# EAGLE design supply (EAGLE 9.6.2)
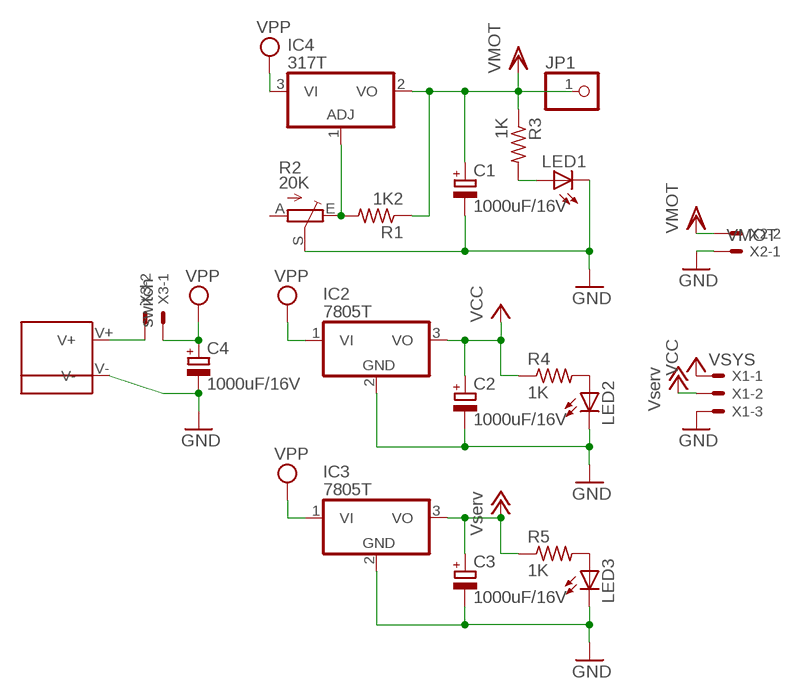
[diagram p0: schematic, sheet 1]

## Parts
C1  1000uF/16V  CPOL-EUE3.5-10  [E3,5-10]
C2  1000uF/16V  CPOL-EUE3.5-10  [E3,5-10]
C3  1000uF/16V  CPOL-EUE3.5-10  [E3,5-10]
C4  1000uF/16V  CPOL-EUE3.5-10  [E3,5-10]
IC2  7805T  [TO220H]
IC3  7805T  [TO220H]
IC4  317T  [TO220H]
JP1  PINHD-1X1  [1X01]
LED1  LED3MM  [LED3MM]
LED2  LED3MM  [LED3MM]
LED3  LED3MM  [LED3MM]
R1  1K2  R-US_0207/10  [0207/10]
R2  20K  TRIM_EU-CA6V  [CA6V]
R3  1K  R-US_0207/10  [0207/10]
R4  1K  R-US_0207/10  [0207/10]
R5  1K  R-US_0207/10  [0207/10]
VIN  CON-XT60M  [CON-XT60M]
X1  VSYS  22-23-2031  [22-23-2031]
X2  VMOT  22-23-2021  [22-23-2021]
X3  switch  22-23-2021  [22-23-2021]

## Nets
+12V: C3.+ IC3.3(VO) R5.1 X1.2 ; supply symbol labelled Vserv
GND: C1.- C2.- C3.- C4.- IC2.2(GND) IC3.2(GND) LED1.K(C) LED2.K(C) LED3.K(C) R2.S VIN.V- X1.3 X2.1
N$1: IC4.1(ADJ) R1.2 R2.E
N$2: LED1.A R3.2
N$3: LED3.A R5.2
N$4: VIN.V+ X3.2
N$5: LED2.A R4.2
VCC: C2.+ IC2.3(VO) R4.1 X1.1
VDD: C1.+ IC4.2(VO) JP1.1 R1.1 R3.1 X2.2 ; supply symbol labelled VMOT
VPP: C4.+ IC2.1(VI) IC3.1(VI) IC4.3(VI) X3.1
Unconnected: R2.A

## Library data of the parts
C1-C4 = rcl:CPOL-EU: POLARIZED CAPACITOR, European symbol
IC2 IC3 = linear:78*: Positive VOLTAGE REGULATOR Source: http://cache.national.com/ds/LM/LM78L05.pdf http://www.fairchildsemi.com/ds/LM/LM7805.pdf
IC4 = linear:*317: Positive VOLTAGE REGULATOR
JP1 = pinhead:PINHD-1X1: PIN HEADER
LED1-LED3 = led:LED: LED OSRAM: - CHIPLED LG R971, LG N971, LY N971, LG Q971, LY Q971, LO R971, LY R971 LH N974, LH R974 LS Q976, LO Q976, LY Q976 LO Q996 - Hyper CHIPLED LW Q18S LB Q993, LB Q99A, LB R99A - SideLED LS A670, LO A670, LY A670, LG A670, LP A670 LB A673, LV A673, LT A673, LW A673 LH A674 LY A675 LS A676, LA A676, LO A676, LY A676, LW A676 LS A679, LY A679, LG A679 - Hyper Micro SIDELED® LS Y876, LA Y876, LO Y876, LY Y876 LT Y87S - SmartLED LW L88C, LW L88S LB L89C, LB L89S, LG L890 LS L89K, LO L89K, LY L89K LS L896, LA L896, LO L896, LY L896 - TOPLED LS T670, LO T670, LY T670, LG T670, LP T670 LSG T670, LSP T670, LSY T670, LOP T670, LYG T670 LG T671, LOG T671, LSG T671 LB T673, LV T673, LT T673, LW T673 LH T674 LS T676, LA T676, LO T676, LY T676, LB T676, LH T676, LSB T676, LW T676 LB T67C, LV T67C, LT T67C, LS T67K, LO T67K, LY T67K, LW E67C LS E67B, LA E67B, LO E67B, LY E67B, LB E67C, LV E67C, LT E67C LW T67C LS T679, LY T679, LG T679 LS T770, LO T770, LY T770, LG T770, LP T770 LB T773, LV T773, LT T773, LW T773 LH T774 LS E675, LA E675, LY E675, LS T675 LS T776, LA T776, LO T776, LY T776, LB T776 LHGB T686 LT T68C, LB T68C - Hyper Mini TOPLED® LB M676 - Mini TOPLED Santana® LG M470 LS M47K, LO M47K, LY M47K Source: http://www.osram.convergy.de LUXEON: - LUMILED® LXK2-PW12-R00, LXK2-PW12-S00, LXK2-PW14-U00, LXK2-PW14-V00 LXK2-PM12-R00, LXK2-PM12-S00, LXK2-PM14-U00 LXK2-PE12-Q00, LXK2-PE12-R00, LXK2-PE12-S00, LXK2-PE14-T00, LXK2-PE14-U00 LXK2-PB12-K00, LXK2-PB12-L00, LXK2-PB12-M00, LXK2-PB14-N00, LXK2-PB14-P00, LXK2-PB14-Q00 LXK2-PR12-L00, LXK2-PR12-M00, LXK2-PR14-Q00, LXK2-PR14-R00 LXK2-PD12-Q00, LXK2-PD12-R00, LXK2-PD12-S00 LXK2-PH12-R00, LXK2-PH12-S00 LXK2-PL12-P00, LXK2-PL12-Q00, LXK2-PL12-R00 Source: www.luxeon.com KINGBRIGHT: KA-3528ASYC Source: www.kingbright.com
R1 R3-R5 = rcl:R-US_: RESISTOR, American symbol
R2 = pot:TRIM_EU-: POTENTIOMETER
VIN = con-XT60M:CON-XT60M
X1 = con-molex:22-23-2031: .100" (2.54mm) Center Header - 3 Pin; MF: MOLEX; MPN: 22-23-2031; OC_FARNELL: 1462950; OC_NEWARK: 30C0862
X2 X3 = con-molex:22-23-2021: .100" (2.54mm) Center Header - 2 Pin; MF: MOLEX; MPN: 22-23-2021; OC_FARNELL: 1462926; OC_NEWARK: 25C3832

## Board
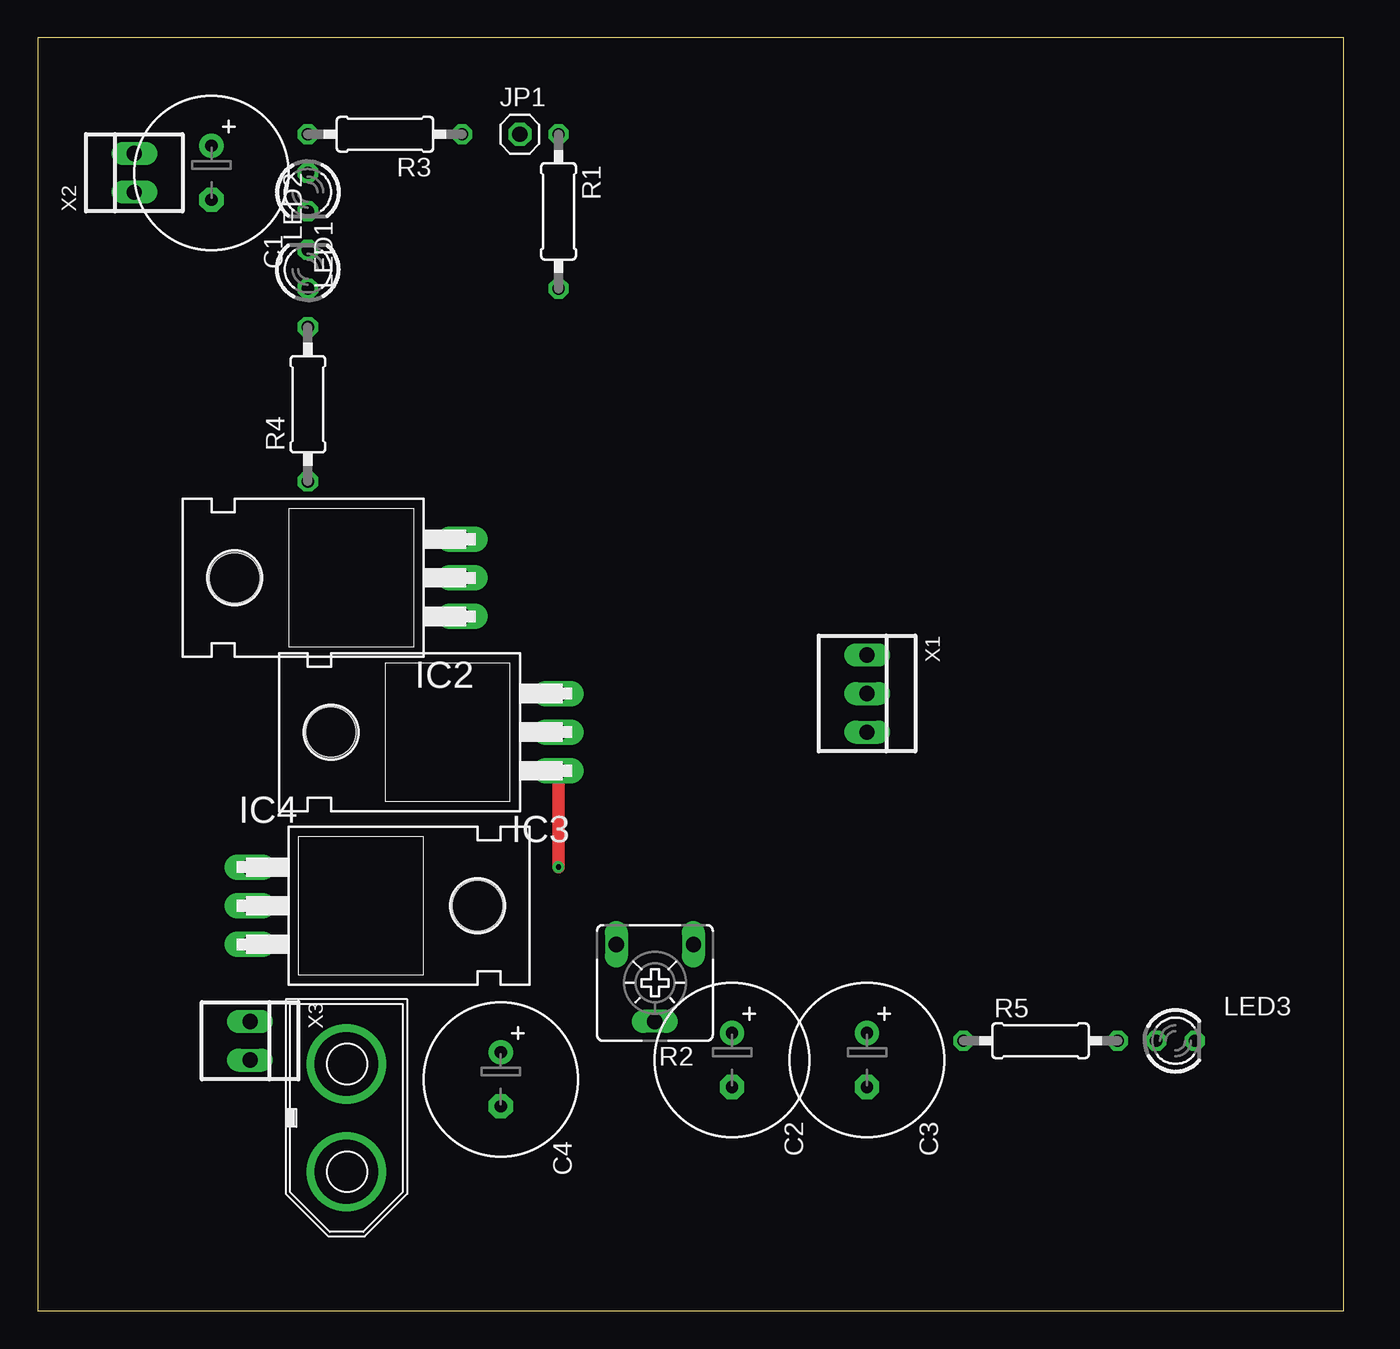
[diagram p1: board, top side]
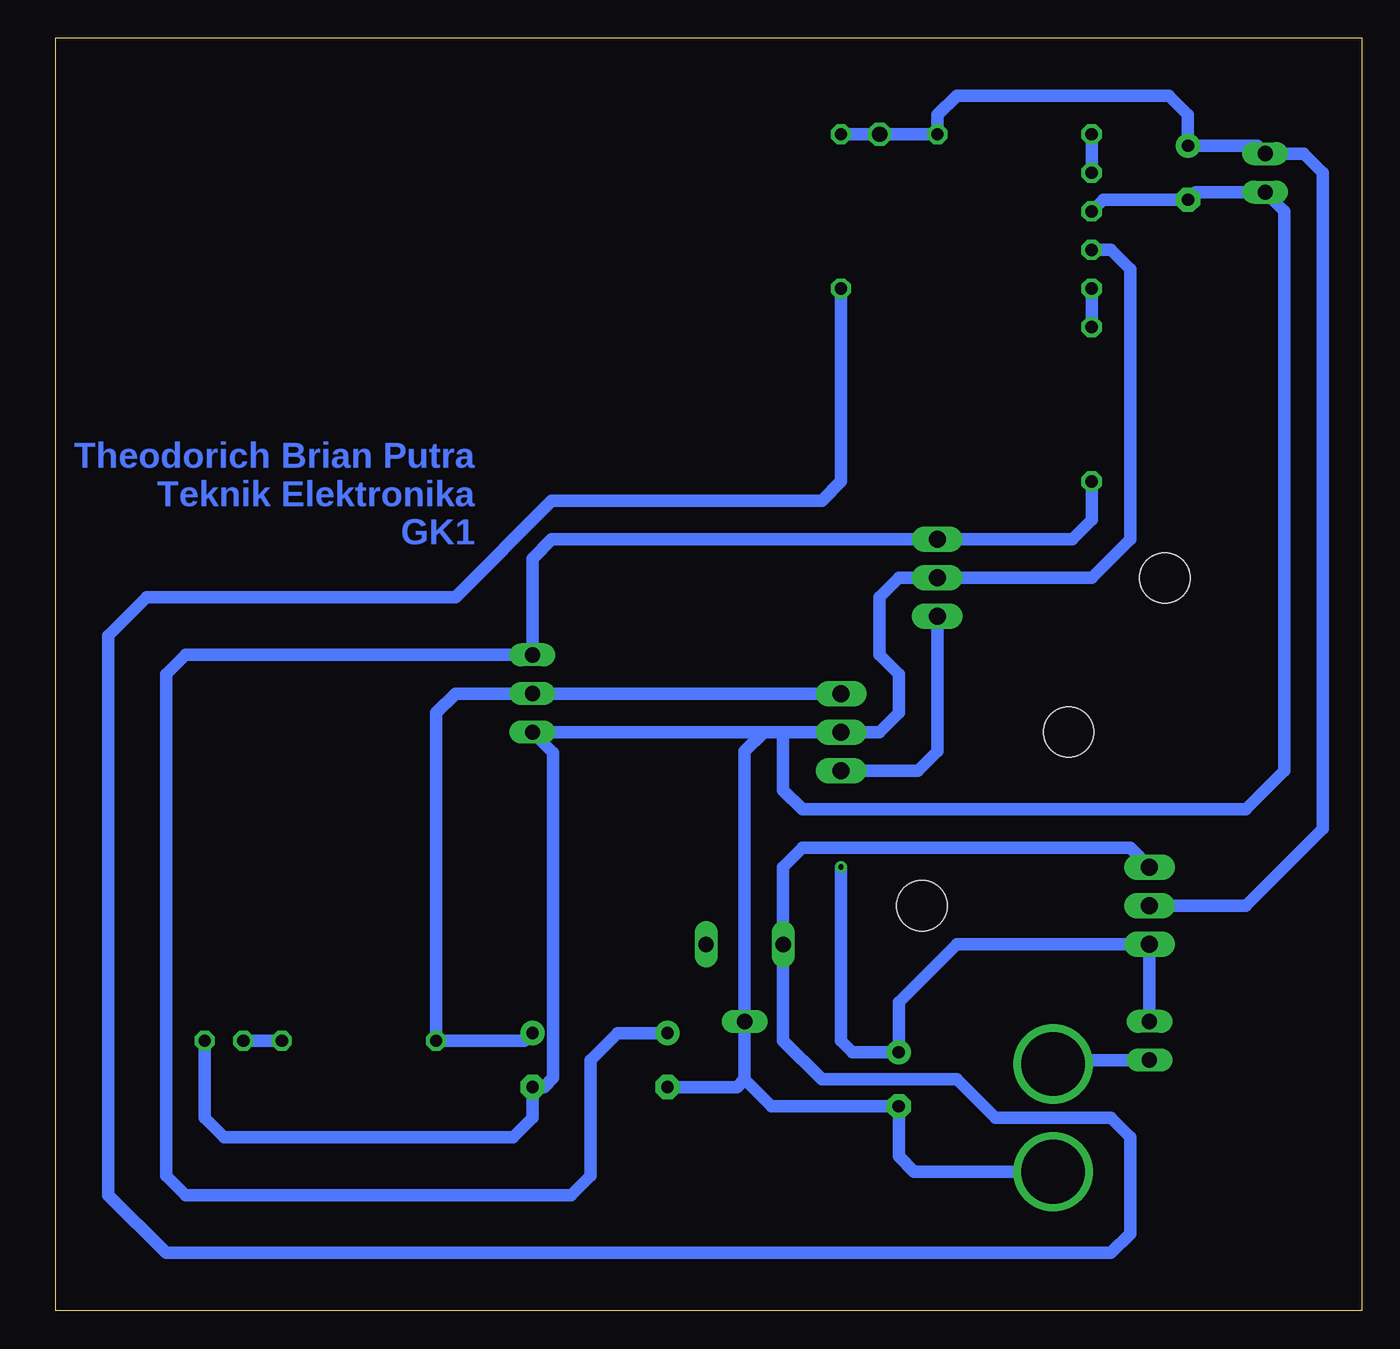
[diagram p2: board, bottom side, seen from below]

Size 86.03 x 83.81 mm. Coordinates in mm from the lower left corner, seen from the top.
Outline: 0,0 86.03,0 86.03,83.81 0,83.81 0,0
Copper layers (1*16): Top 0.035mm / dielectric 1.5mm / Bottom 0.035mm
Design rules "default": minimum track width 6mil, minimum drill 0.35mm, track to track 6mil, track to pad 6mil, pad to pad 6mil, via to via 6mil, smd to smd 6mil, copper to edge 40mil, drill to drill 6mil, minimum pad ring 10mil, minimum via ring 8mil, stop-mask expansion 4mil, vias tented up to drill 0mil, thermal gap 10mil

### Footprints (pad centres in the part's own frame; a part is rotated, then mirrored left to right if it is on the bottom)
E3,5-10 = drill 0.813 pad 1.6: + -1.778,0 | drill 0.813 pad 1.6 octagon: - 1.778,0
TO220H = drill 1.118 long: 1 -2.54,-10.16; 2 0,-10.16; 3 2.54,-10.16 | hole 3.302: 0,4.826
1X01 = drill 1.016 octagon: 1 0,0
LED3MM = drill 0.813 octagon: A -1.27,0; K 1.27,0
0207/10 = drill 0.813 octagon: 1 -5.08,0; 2 5.08,0
CA6V = drill 1.016 long: A -2.54,-2.54; E 2.54,-2.54; S 0,2.54
CON-XT60M = drill 4.2: V+ -3.55,0; V- 3.55,0
22-23-2031 = drill 1 long: 1 -2.54,0; 2 0,0; 3 2.54,0
22-23-2021 = drill 1 long: 1 -1.27,0; 2 1.27,0

### Placement (x,y rotation side)
C1  11.43,74.93 270 top
C2  45.72,16.51 270 top
C3  54.61,16.51 270 top
C4  30.48,15.24 270 top
IC2  17.78,48.26 90 top
IC3  24.13,38.1 90 top
IC4  24.13,26.67 270 top
JP1  31.75,77.47 0 top
LED1  17.78,73.66 270 top
LED2  17.78,68.58 90 top
LED3  74.93,17.78 0 top
R1  34.29,72.39 270 top
R2  40.64,21.59 180 top
R3  22.86,77.47 180 top
R4  17.78,59.69 90 top
R5  66.04,17.78 0 top
VIN  20.32,12.7 270 top
X1  54.61,40.64 270 top
X2  6.35,74.93 90 top
X3  13.97,17.78 270 top

### Tracks (layer width: path | path; a pad name or v marks a point on that pad's centre or on a via)
+12V
  Bottom 0.813: C3.+ 55.12,17.78 R5.1 60.96,39.37 59.69,40.64 X1.2 IC3.3
GND
  Bottom 0.813: R2.S 41.4,19.05 | LED3.K 76.2,12.7 74.93,11.43 55.88,11.43 54.61,12.7 C3.- 53.85,14.73 53.25,15.33 53.25,36.74 X1.3 39.37,38.1 | R2.S 40.64,15.24 | 40.64,15.24 41.15,14.73 C2.- | 38.1,38.1 IC3.2 31.75,38.1 30.48,39.37 30.48,41.91 31.75,43.18 31.75,46.99 30.48,48.26 IC2.2 17.78,48.26 15.24,50.8 15.24,68.58 16.51,69.85 LED2.K | 38.1,38.1 39.37,38.1 | 39.37,38.1 40.64,36.83 R2.S | 40.64,15.24 38.86,13.46 C4.- 30.48,10.16 29.47,9.15 VIN.V- | LED1.K 17.02,73.15 C1.- 10.92,73.66 X2.1 5.08,72.39 5.08,35.56 7.62,33.02 36.83,33.02 38.1,34.29 38.1,38.1
N$1
  Bottom 0.813: IC4.1 15.24,30.48 36.83,30.48 38.1,29.21 R2.E 38.1,17.78 35.56,15.24 26.67,15.24 24.13,12.7 16.51,12.7 15.24,11.43 15.24,5.08 16.51,3.81 78.74,3.81 82.55,7.62 82.55,44.45 80.01,46.99 59.69,46.99 53.34,53.34 35.56,53.34 34.29,54.61 R1.2
N$2
  Bottom 0.813: LED1.A R3.2
N$3
  Bottom 0.813: R5.2 LED3.A
N$4
  Bottom 0.813: VIN.V+ 20.06,16.51 X3.2
N$5
  Bottom 0.813: LED2.A R4.2
VCC
  Bottom 0.813: R4.1 17.78,52.07 19.05,50.8 IC2.3 53.34,50.8 54.61,49.53 X1.1 77.47,43.18 78.74,41.91 78.74,8.89 77.47,7.62 52.07,7.62 50.8,8.89 50.8,16.51 49.02,18.29 C2.+
VDD
  Bottom 0.813: R1.1 JP1.1 R3.1 27.94,78.74 26.67,80.01 12.7,80.01 11.43,78.74 C1.+ 6.86,76.71 X2.2 3.81,76.2 2.54,74.93 2.54,31.75 7.62,26.67 IC4.2
VPP  (via drill 0.35)
  Top 0.813: v34.29,29.21 IC3.1
  Bottom 0.813: IC3.1 29.21,35.56 27.94,36.83 IC2.1 | X3.1 IC4.3 26.67,24.13 30.48,20.32 C4.+ 33.53,17.02 34.29,17.78 v34.29,29.21

### Text on the board
Bottom: Theodorich Brian Putra / Teknik Elektronika / GK1